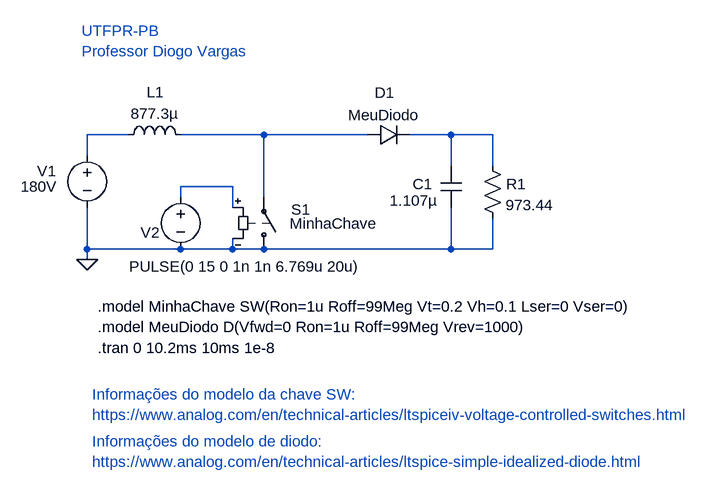
[diagram p0: schematic Conv-A04-Boost_DCM_(LTspice_ideal_v2).asc]
Conv-A04-Boost_DCM_(LTspice_ideal_v2).asc, the LTspice schematic file:
Version 4
SHEET 1 1432 680
WIRE 160 -64 96 -64
WIRE 368 -64 240 -64
WIRE 528 -64 368 -64
WIRE 656 -64 592 -64
WIRE 720 -64 656 -64
WIRE 96 -32 96 -64
WIRE 656 -16 656 -64
WIRE 720 -16 720 -64
WIRE 320 16 240 16
WIRE 240 32 240 16
WIRE 368 32 368 -64
WIRE 320 48 320 16
WIRE 96 112 96 48
WIRE 240 112 96 112
WIRE 320 112 320 96
WIRE 320 112 240 112
WIRE 368 112 320 112
WIRE 656 112 656 48
WIRE 656 112 368 112
WIRE 720 112 720 64
WIRE 720 112 656 112
WIRE 96 128 96 112
FLAG 96 128 0
SYMBOL voltage 96 -48 R0
WINDOW 3 -102 64 Left 2
WINDOW 0 -77 40 Left 2
SYMATTR Value 180V
SYMATTR InstName V1
SYMBOL voltage 240 16 R0
WINDOW 0 -47 55 Top 2
WINDOW 3 100 138 Bottom 2
WINDOW 123 0 0 Left 2
WINDOW 39 0 0 Left 2
SYMATTR InstName V2
SYMATTR Value PULSE(0 15 0 1n 1n 6.769u 20u)
SYMBOL ind 144 -48 R270
WINDOW 0 66 57 VTop 2
WINDOW 3 64 56 VBottom 2
SYMATTR InstName L1
SYMATTR Value 877.3µ
SYMBOL cap 640 -16 R0
WINDOW 0 -12 28 Right 2
WINDOW 3 -4 53 Right 2
SYMATTR InstName C1
SYMATTR Value 1.107µ
SYMBOL res 704 -32 R0
WINDOW 0 37 44 Left 2
SYMATTR InstName R1
SYMATTR Value 973.44
SYMBOL diode 528 -48 R270
WINDOW 0 65 26 VTop 2
WINDOW 3 62 25 VBottom 2
SYMATTR InstName D1
SYMATTR Value MeuDiodo
SYMBOL sw 368 128 M180
WINDOW 0 42 77 Left 2
WINDOW 3 40 55 Left 2
SYMATTR InstName S1
SYMATTR Value MinhaChave
TEXT 112 264 Left 2 !.tran 0 10.2ms 10ms 1e-8
TEXT 112 232 Left 2 !.model MeuDiodo D(Vfwd=0 Ron=1u Roff=99Meg Vrev=1000)
TEXT 88 -224 Left 2 ;UTFPR-PB\nProfessor Diogo Vargas
TEXT 112 200 Left 2 !.model MinhaChave SW(Ron=1u Roff=99Meg Vt=0.2 Vh=0.1 Lser=0 Vser=0)
TEXT 104 336 Left 2 ;Informações do modelo da chave SW:\nhttps://www.analog.com/en/technical-articles/ltspiceiv-voltage-controlled-switches.html
TEXT 104 408 Left 2 ;Informações do modelo de diodo:\nhttps://www.analog.com/en/technical-articles/ltspice-simple-idealized-diode.html

The netlist it stands for:
* Conv-A04-Boost_DCM_(LTspice_ideal_v2).asc
V1 N001 0 180V
V2 N004 0 PULSE(0 15 0 1n 1n 6.769u 20u)
L1 N001 N002 877.3µ
C1 N003 0 1.107µ
R1 N003 0 973.44
D1 N002 N003 MeuDiodo
S1 0 N002 N004 0 MinhaChave
.model D D
.lib standard.dio
.tran 0 10.2ms 10ms 1e-8
.model MeuDiodo D(Vfwd=0 Ron=1u Roff=99Meg Vrev=1000)
* UTFPR-PB
* Professor Diogo Vargas
.model MinhaChave SW(Ron=1u Roff=99Meg Vt=0.2 Vh=0.1 Lser=0 Vser=0)
* Informações do modelo da chave SW:
* https://www.analog.com/en/technical-articles/ltspiceiv-voltage-controlled-switches.html
* Informações do modelo de diodo:
* https://www.analog.com/en/technical-articles/ltspice-simple-idealized-diode.html
.backanno
.end